# Altium schematic sheet ADC_Input.SchDoc
size A3
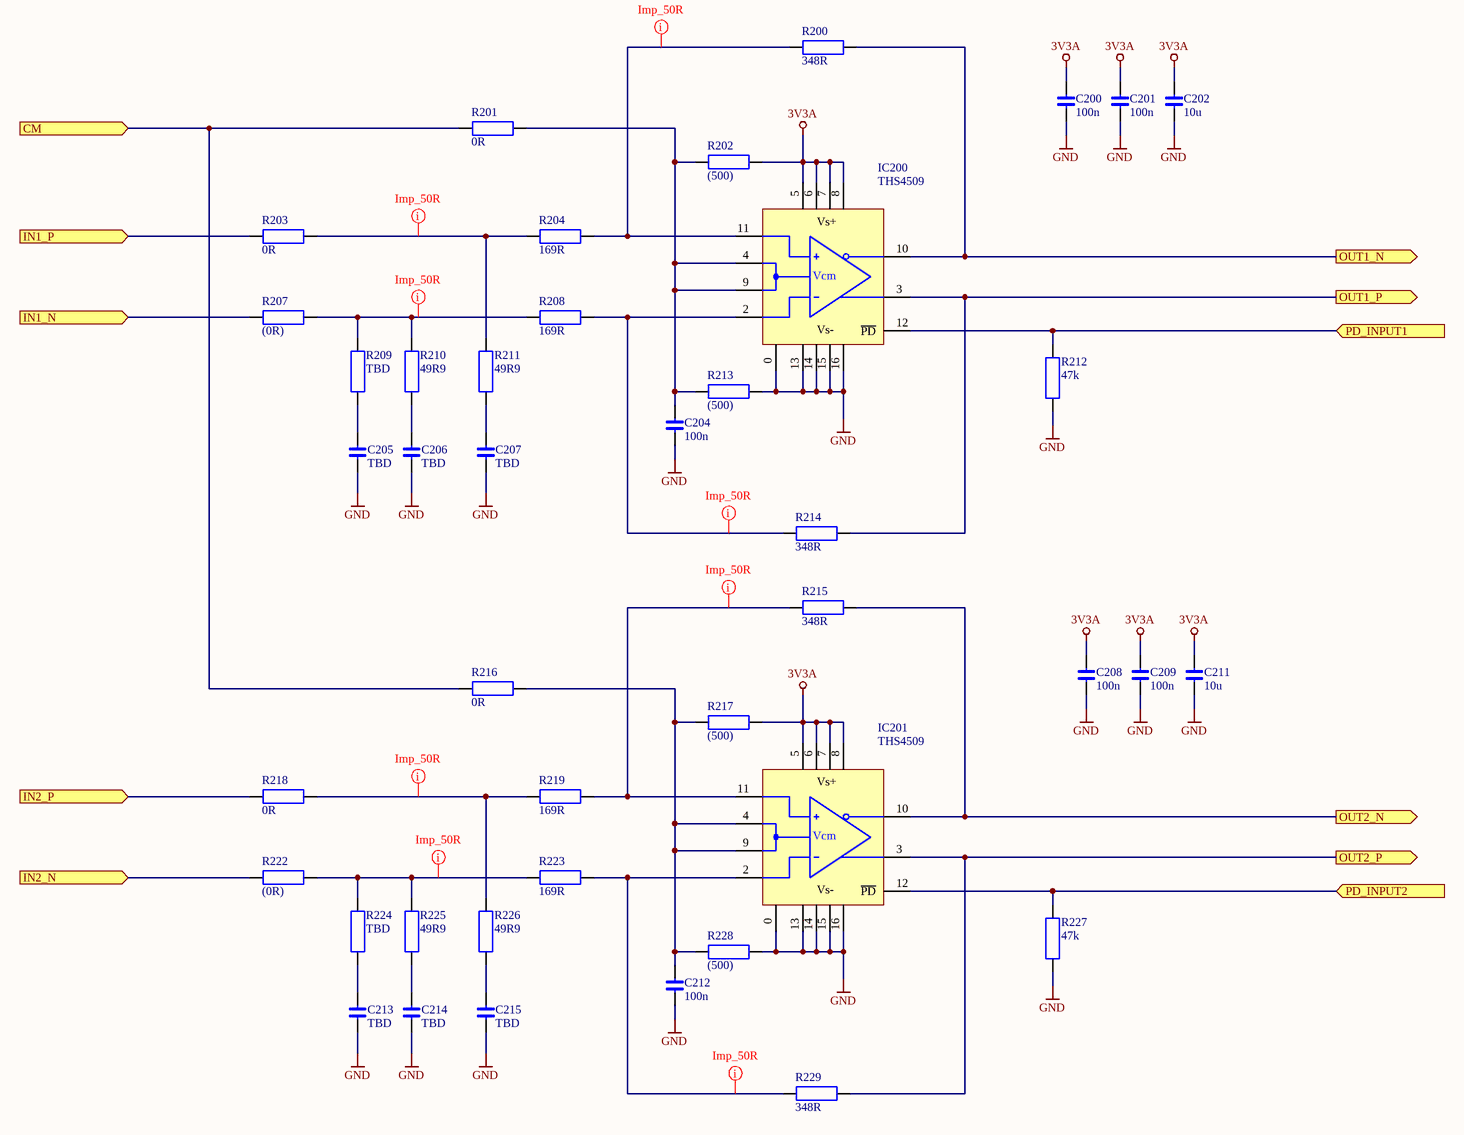
[diagram p0: ADC_Input.SchDoc]

## Parts
C200  100n  [0603 SMALL OUTLINE]
C201  100n  [0603 SMALL OUTLINE]
C202  10u  [0805 SMALL OUTLINE]
C204  100n  [0603 SMALL OUTLINE]
C205  TBD  [0603 SMALL OUTLINE]
C206  TBD  [0603 SMALL OUTLINE]
C207  TBD  [0603 SMALL OUTLINE]
C208  100n  [0603 SMALL OUTLINE]
C209  100n  [0603 SMALL OUTLINE]
C211  10u  [0805 SMALL OUTLINE]
C212  100n  [0603 SMALL OUTLINE]
C213  TBD  [0603 SMALL OUTLINE]
C214  TBD  [0603 SMALL OUTLINE]
C215  TBD  [0603 SMALL OUTLINE]
IC200  THS4509  [QFN16_LONG]
IC201  THS4509  [QFN16_LONG]
R200  348R  [0603 SMALL OUTLINE]
R201  0R  [0603 SMALL OUTLINE]
R202  (500)  [0603 SMALL OUTLINE]
R203  0R  [0603 SMALL OUTLINE]
R204  169R  [0603 SMALL OUTLINE]
R207  (0R)  [0603 SMALL OUTLINE]
R208  169R  [0603 SMALL OUTLINE]
R209  TBD  [0603 SMALL OUTLINE]
R210  49R9  [0603 SMALL OUTLINE]
R211  49R9  [0603 SMALL OUTLINE]
R212  47k  [0603 SMALL OUTLINE]
R213  (500)  [0603 SMALL OUTLINE]
R214  348R  [0603 SMALL OUTLINE]
R215  348R  [0603 SMALL OUTLINE]
R216  0R  [0603 SMALL OUTLINE]
R217  (500)  [0603 SMALL OUTLINE]
R218  0R  [0603 SMALL OUTLINE]
R219  169R  [0603 SMALL OUTLINE]
R222  (0R)  [0603 SMALL OUTLINE]
R223  169R  [0603 SMALL OUTLINE]
R224  TBD  [0603 SMALL OUTLINE]
R225  49R9  [0603 SMALL OUTLINE]
R226  49R9  [0603 SMALL OUTLINE]
R227  47k  [0603 SMALL OUTLINE]
R228  (500)  [0603 SMALL OUTLINE]
R229  348R  [0603 SMALL OUTLINE]

## Ports
CM (in), IN1_N (in), IN1_P (in), IN2_N (in), IN2_P (in), OUT1_N (out), OUT1_P (out), OUT2_N (out), OUT2_P (out), PD_INPUT1 (in), PD_INPUT2 (in)

## Nets
3V3A: C200.1 C201.1 C202.1 C208.1 C209.1 C211.1 IC200.5(Vs+) IC200.6(Vs+) IC200.7(Vs+) IC200.8(Vs+) IC201.5(Vs+) IC201.6(Vs+) IC201.7(Vs+) IC201.8(Vs+) R202.1 R217.1
GND: C200.2 C201.2 C202.2 C204.2 C205.2 C206.2 C207.2 C208.2 C209.2 C211.2 C212.2 C213.2 C214.2 C215.2 IC200.0(PAD) IC200.13(Vs-) IC200.14(Vs-) IC200.15(Vs-) IC200.16(Vs-) IC201.0(PAD) IC201.13(Vs-) IC201.14(Vs-) IC201.15(Vs-) IC201.16(Vs-) R212.1 R213.1 R227.1 R228.1
CM: R201.1 R216.1 ; port CM
IN1_N: R207.1 ; port IN1_N
IN1_P: R203.1 ; port IN1_P
IN2_N: R222.1 ; port IN2_N
IN2_P: R218.1 ; port IN2_P
OUT1_N: IC200.10(-OUT) R200.1 ; port OUT1_N
OUT1_P: IC200.3(+OUT) R214.1 ; port OUT1_P
OUT2_N: IC201.10(-OUT) R215.1 ; port OUT2_N
OUT2_P: IC201.3(+OUT) R229.1 ; port OUT2_P
PD_INPUT1: IC200.12(~{PD}) R212.2 ; port PD_INPUT1
PD_INPUT2: IC201.12(~{PD}) R227.2 ; port PD_INPUT2
NetC204_1: C204.1 IC200.4(CM) IC200.9(CM) R201.2 R202.2 R213.2
NetC205_1: C205.1 R209.1
NetC206_1: C206.1 R210.1
NetC207_1: C207.1 R211.1
NetC212_1: C212.1 IC201.4(CM) IC201.9(CM) R216.2 R217.2 R228.2
NetC213_1: C213.1 R224.1
NetC214_1: C214.1 R225.1
NetC215_1: C215.1 R226.1
NetIC200_2: IC200.2(-IN) R208.1 R214.2
NetIC200_11: IC200.11(+IN) R200.2 R204.1
NetIC201_2: IC201.2(-IN) R223.1 R229.2
NetIC201_11: IC201.11(+IN) R215.2 R219.1
NetR203_2: R203.2 R204.2 R211.2
NetR207_2: R207.2 R208.2 R209.2 R210.2
NetR218_2: R218.2 R219.2 R226.2
NetR222_2: R222.2 R223.2 R224.2 R225.2

## Layout directives
net class Imp_50R: NetIC200_2, NetIC200_11, NetIC201_2, NetIC201_11, NetR203_2, NetR207_2, NetR218_2, NetR222_2

## Notes on the sheet
- Title
- Size:
- Date:
- A3
- Number:
- Time:
- Revision:
- Sheet
- of
- File:
- (in symbol THS4509) Vcm

## Library data of the parts
C200-C202 C204-C209 C211-C215 = C
IC200 IC201 = THS4509: WIDEBAND, LOW-NOISE, LOW-DISTORTION, FULLY-DIFFERENTIAL AMPLIFIER
R200-R204 R207-R219 R222-R229 = R